# Altium schematic sheet Sheet2.SchDoc
size A
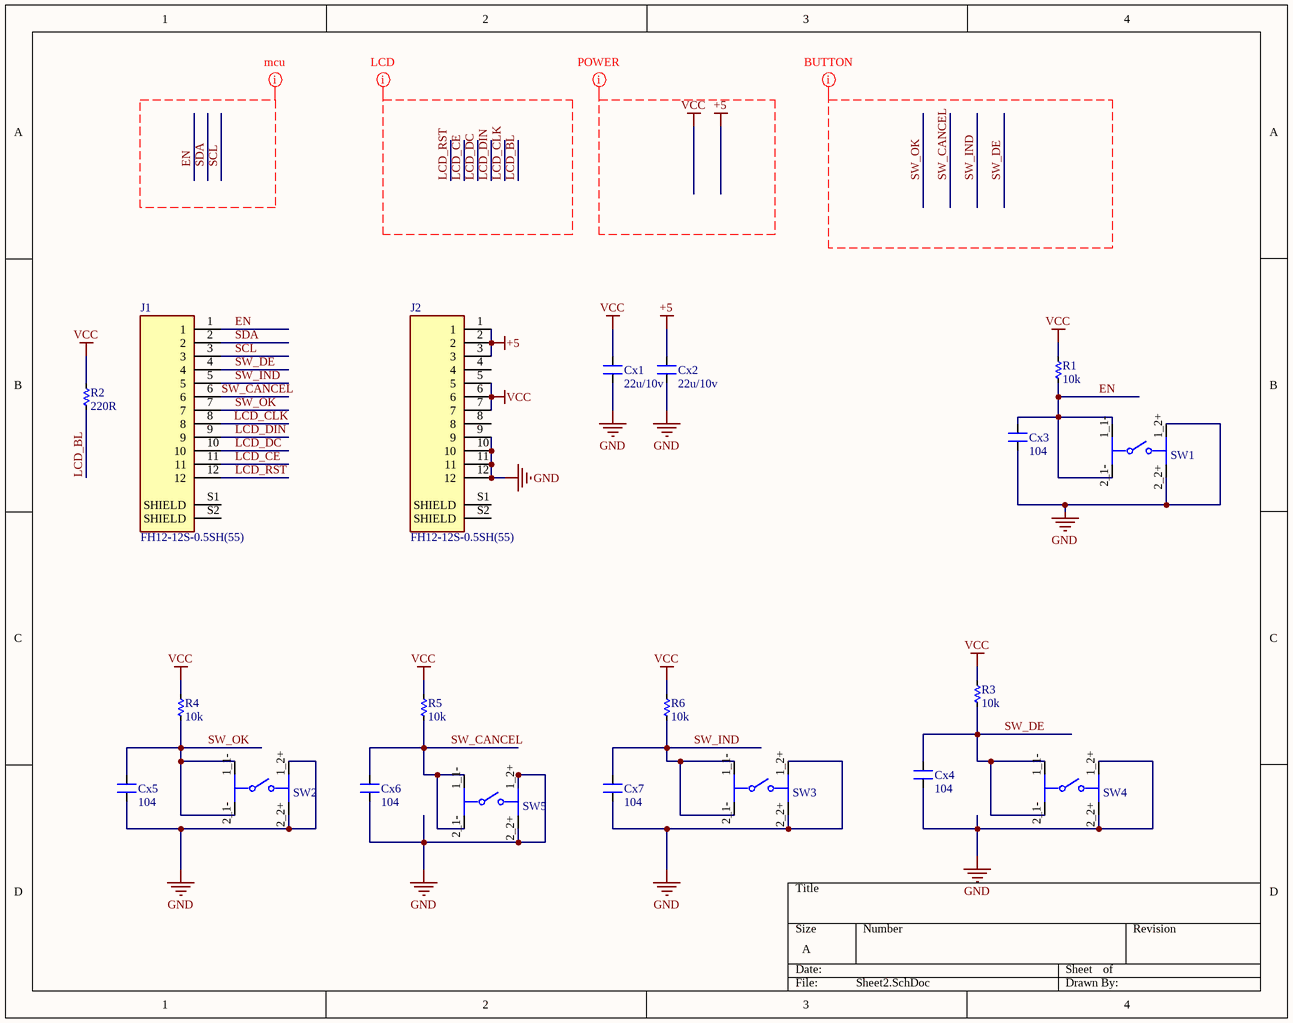
[diagram p0: Sheet2.SchDoc]

## Parts
Cx1  22u/10v  [CN-SMD-1206]
Cx2  22u/10v  [CN-SMD-1206]
Cx3  104  [CN-SMD-0603]
Cx4  104  [CN-SMD-0603]
Cx5  104  [CN-SMD-0603]
Cx6  104  [CN-SMD-0603]
Cx7  104  [CN-SMD-0603]
J1  FH12-12S-0.5SH(55)  [HIROSE_FH12-12S-0.5SH(55)]
J2  FH12-12S-0.5SH(55)  [HIROSE_FH12-12S-0.5SH(55)]
R1  10k  [RES-SMD-0603]
R2  220R  [RES-SMD-0603]
R3  10k  [RES-SMD-0603]
R4  10k  [RES-SMD-0603]
R5  10k  [RES-SMD-0603]
R6  10k  [RES-SMD-0603]
SW1  7914J-1-000  [Bourns_Inc_0_MFG]  (value not drawn)
SW2  7914J-1-000  [Bourns_Inc_0_MFG]  (value not drawn)
SW3  7914J-1-000  [Bourns_Inc_0_MFG]  (value not drawn)
SW4  7914J-1-000  [Bourns_Inc_0_MFG]  (value not drawn)
SW5  7914J-1-000  [Bourns_Inc_0_MFG]  (value not drawn)

## Nets
+5: Cx2.2 J2.1 J2.2 J2.3
GND: Cx1.1 Cx2.1 Cx3.1 Cx4.1 Cx5.1 Cx6.1 Cx7.1 J2.9 J2.10 J2.11 J2.12 SW1.1_2+(1_2+) SW1.2_2+(2_2+) SW2.1_2+(1_2+) SW2.2_2+(2_2+) SW3.1_2+(1_2+) SW3.2_2+(2_2+) SW4.1_2+(1_2+) SW4.2_2+(2_2+) SW5.1_2+(1_2+) SW5.2_2+(2_2+)
VCC: Cx1.2 J2.5 J2.6 J2.7 R1.2 R2.2 R3.2 R4.2 R5.2 R6.2
EN: Cx3.2 J1.1 R1.1 SW1.1_1-(1_1-) SW1.2_1-(2_1-)
LCD_BL: R2.1
LCD_CE: J1.11
LCD_CLK: J1.8
LCD_DC: J1.10
LCD_DIN: J1.9
LCD_RST: J1.12
SCL: J1.3
SDA: J1.2
SW_CANCEL: Cx6.2 J1.6 R5.1 SW5.1_1-(1_1-) SW5.2_1-(2_1-)
SW_DE: Cx4.2 J1.4 R3.1 SW4.1_1-(1_1-) SW4.2_1-(2_1-)
SW_IND: Cx7.2 J1.5 R6.1 SW3.1_1-(1_1-) SW3.2_1-(2_1-)
SW_OK: Cx5.2 J1.7 R4.1 SW2.1_1-(1_1-) SW2.2_1-(2_1-)

Not connected (* = marked no-connect by the designer): J1 S1(SHIELD) S2(SHIELD); J2 4 8 S1(SHIELD) S2(SHIELD)

## Layout directives
net class LCD: LCD_BL, LCD_CE, LCD_CLK, LCD_DC, LCD_DIN, LCD_RST
net class POWER: +5, VCC
net class BUTTON: SW_CANCEL, SW_DE, SW_IND, SW_OK
net class mcu: EN, SCL, SDA

## Library data of the parts
Cx1-Cx7 = CN: Value: 33pF
J1 J2 = FH12-12S-0.5SH(55): 12 Position FFC, FPC Connector Contacts, Bottom 0.020 _0.50mm_ Surface Mount, Right Angle; MF: Hirose; MP: FH12-12S-0.5SH_55_; Availability: Unavailable; Price: None; Package: None; Value: *; SnapEDA_Link: https://www.snapeda.com/parts/FH12-12S-0.5SH%2855%29/Hirose%20Electric%20Co%20Ltd/view-part/110249/?ref=snap
R1-R6 = Res-SMD: Resistor; Manufacturer: Generic Components; Class: Passive; Published: 08/06/2000; Publisher: Altium Hobart Technology Centre